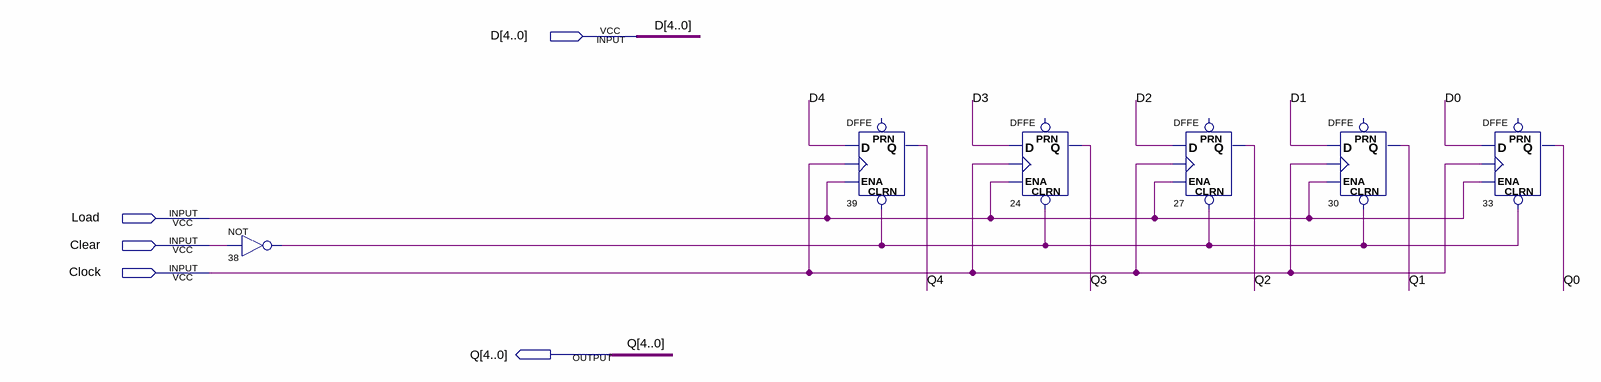
[diagram p0: schematic sheet]
// Quartus schematic reg5.bdf as structural Verilog: 6 symbols, 5 pins
module reg5 (
  input  [4:0] D,
  input  Load,
  input  Clear,
  input  Clock,
  output [4:0] Q
);

  wire n38_out;

  not u_38 (n38_out, Clear);
  DFFE u_39 (.CLRN(n38_out), .D(D[4]), .CLK(Clock), .ENA(Load), .Q(Q[4]));  // open: PRN
  DFFE u_24 (.CLRN(n38_out), .D(D[3]), .CLK(Clock), .ENA(Load), .Q(Q[3]));  // open: PRN
  DFFE u_27 (.CLRN(n38_out), .D(D[2]), .CLK(Clock), .ENA(Load), .Q(Q[2]));  // open: PRN
  DFFE u_30 (.CLRN(n38_out), .D(D[1]), .CLK(Clock), .ENA(Load), .Q(Q[1]));  // open: PRN
  DFFE u_33 (.CLRN(n38_out), .D(D[0]), .CLK(Clock), .ENA(Load), .Q(Q[0]));  // open: PRN
endmodule
